# Altium project activator.PrjPcb
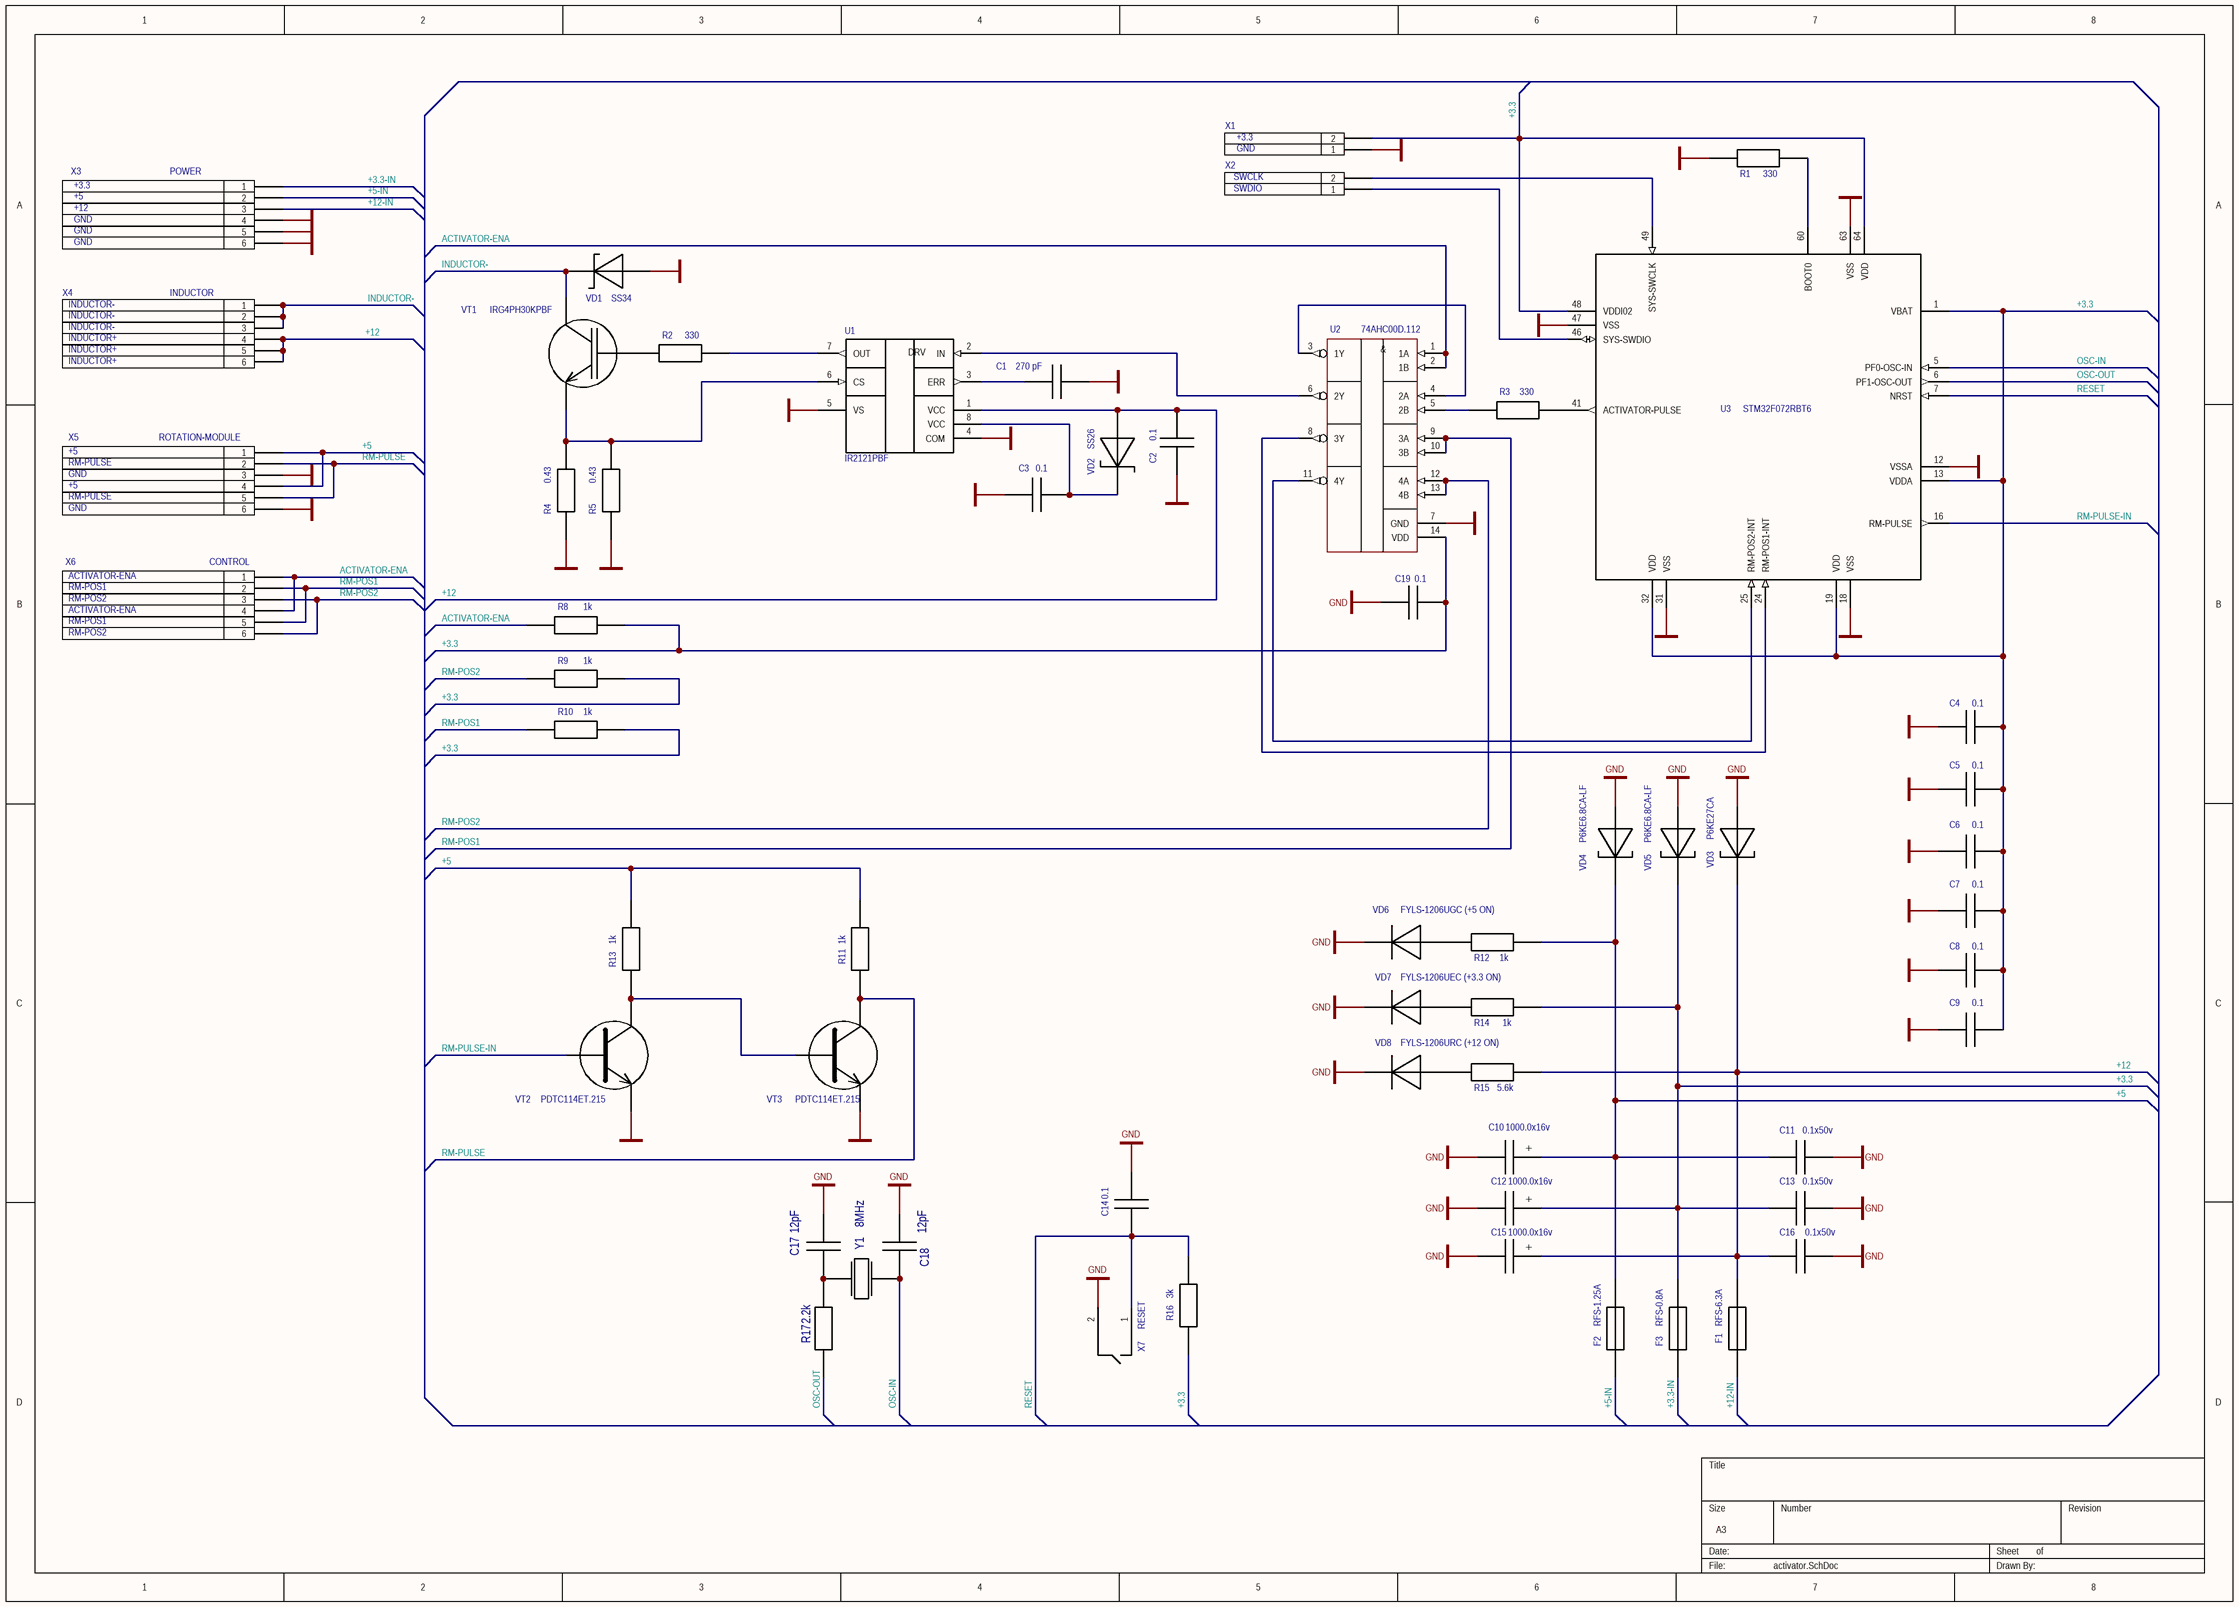
[diagram p0: activator.SchDoc]
1 sheet, 59 parts. Net scope: global (net labels, ports and power ports of the same name join across sheets).
Board file: activator.PcbDoc

## Sheet activator.SchDoc
size A3

### Parts
C1  270 pF  [CAPC3216X05N]
C2  0.1  [CAPC3216X05N]
C3  0.1  [CAPC3216X05N]
C4  0.1  [CAPC1608X05N]
C5  0.1  [CAPC1608X05N]
C6  0.1  [CAPC1608X05N]
C7  0.1  [CAPC1608X05N]
C8  0.1  [CAPC1608X05N]
C9  0.1  [CAPC1608X05N]
C10  1000.0x16v  [C-LOW-ESR-10-12.5]
C11  0.1x50v  [CAPC3216X05N]
C12  1000.0x16v  [C-LOW-ESR-10-12.5]
C13  0.1x50v  [CAPC3216X05N]
C14  0.1  [CAPC1608X05N]
C15  1000.0x16v  [C-LOW-ESR-10-12.5]
C16  0.1x50v  [CAPC3216X05N]
C17  12pF  [CAPC1608X05N]
C18  12pF  [CAPC1608X05N]
C19  0.1  [CAPC2012X04N]
F1  RFS-6.3A  [MRT-FUSE]
F2  RFS-1.25A  [MRT-FUSE]
F3  RFS-0.8A  [MRT-FUSE]
R1  330  [RESC1608X05N]
R2  330  [RESC3216X05N]
R3  330  [RESC2012X04N]
R4  0.43  [SQP-5W]
R5  0.43  [SQP-5W]
R8  1k  [RESC3216X05N]
R9  1k  [RESC3216X05N]
R10  1k  [RESC3216X05N]
R11  1k  [RESC2012X04N]
R12  1k  [RESC2012X04N]
R13  1k  [RESC2012X04N]
R14  1k  [RESC2012X04N]
R15  5.6k  [RESC2012X04N]
R16  3k  [RESC1608X05N]
R17  2.2k  [RESC1608X05N]
U1  IR2121PBF  [DIP8]
U2  74AHC00D.112  [SOIC127P600X175-14N]
U3  STM32F072RBT6  [TSQFP50P1200X1200X160-64N]
VD1  SS34  [DIOM6959X26N]
VD2  SS26  [DIOM4336X21N]
VD3  P6KE27CA  [P6KE27CA]
VD4  P6KE6.8CA-LF  [P6KE27CA]
VD5  P6KE6.8CA-LF  [P6KE27CA]
VD6  FYLS-1206UGC (+5 ON)  [CAPMP3216X11N]
VD7  FYLS-1206UEC (+3.3 ON)  [CAPMP3216X11N]
VD8  FYLS-1206URC (+12 ON)  [CAPMP3216X11N]
VT1  IRG4PH30KPBF  [TO-247AC]
VT2  PDTC114ET.215  [SOT95P238X102-3N]
VT3  PDTC114ET.215  [SOT95P238X102-3N]
X1  Jamper ZL201  [ZL201-2]  (value not drawn)
X2  Jamper ZL201  [ZL201-2]  (value not drawn)
X3  POWER  [MINI-FIT-6WAY-SM]
X4  INDUCTOR  [MINI-FIT-6WAY-SM]
X5  ROTATION-MODULE  [MINI-FIT-6WAY-SM]
X6  CONTROL  [MINI-FIT-6WAY-SM]
X7  RESET  [TACT SWITCH]
Y1  8MHz  [HC49LT]

### Nets
GND: C1.2 C2.1 C3.1 C4.1 C5.1 C6.1 C7.1 C8.1 C9.1 C10.2 C11.2 C12.2 C13.2 C14.2 C15.2 C16.2 C17.1 C18.1 C19.1 R1.1 R4.1 R5.1 U1.4(COM) U1.5(VS) U2.7(GND) U3.12(VSSA) U3.18(VSS) U3.31(VSS) U3.47(VSS) U3.63(VSS) VD1.2(A) VD3.A VD4.A VD5.A VD6.1(C) VD7.1(C) VD8.1(C) VT2.2(E) VT3.2(E) X1.1 X3.4 X3.5 X3.6 X5.3 X5.6 X7.2
+3.3: C4.2 C5.2 C6.2 C7.2 C8.2 C9.2 C12.1(+) C13.1 C19.2 F3.1 R8.2 R9.2 R10.2 R14.2 R16.1 U2.14(VDD) U3.1(VBAT) U3.13(VDDA) U3.19(VDD) U3.32(VDD) U3.48(VDDI02) U3.64(VDD) VD5.K X1.2
+3.3-IN: F3.2 X3.1
+5: C10.1(+) C11.1 F2.1 R11.2 R12.2 R13.2 VD4.K X5.1 X5.4
+5-IN: F2.2 X3.2
+12: C2.2 C15.1(+) C16.1 F1.1 R15.2 U1.1(VCC) VD2.2(A) VD3.K X4.4 X4.5 X4.6
+12-IN: F1.2 X3.3
ACTIVATOR-ENA: R8.1 U2.1(1A) U2.2(1B) X6.1 X6.4
INDUCTOR-: VD1.1(C) VT1.2(C) X4.1 X4.2 X4.3
OSC-IN: C18.2 U3.5(PF0-OSC-IN) Y1.2
OSC-OUT: R17.2 U3.6(PF1-OSC-OUT)
RESET: C14.1 R16.2 U3.7(NRST) X7.1
RM-POS1: R10.1 U2.9(3A) U2.10(3B) X6.2 X6.5
RM-POS2: R9.1 U2.12(4A) U2.13(4B) X6.3 X6.6
RM-PULSE: R11.1 VT3.3(C) X5.2 X5.5
RM-PULSE-IN: U3.16(RM-PULSE) VT2.1(B)
NetC1_1: C1.1 U1.3(ERR)
NetC3_2: C3.2 U1.8(VCC) VD2.1(C)
NetC17_2: C17.2 R17.1 Y1.1
NetR1_2: R1.2 U3.60(BOOT0)
NetR2_1: R2.1 VT1.1(G)
NetR2_2: R2.2 U1.7(OUT)
NetR3_1: R3.1 U2.5(2B)
NetR3_2: R3.2 U3.41(ACTIVATOR-PULSE)
NetR4_2: R4.2 R5.2 U1.6(CS) VT1.3(E)
NetR12_1: R12.1 VD6.2(A)
NetR13_1: R13.1 VT2.3(C) VT3.1(B)
NetR14_1: R14.1 VD7.2(A)
NetR15_1: R15.1 VD8.2(A)
NetU1_2: U1.2(IN) U2.6(2Y)
NetU2_3: U2.3(1Y) U2.4(2A)
NetU2_8: U2.8(3Y) U3.24(RM-POS1-INT)
NetU2_11: U2.11(4Y) U3.25(RM-POS2-INT)
NetU3_46: U3.46(SYS-SWDIO) X2.1
NetU3_49: U3.49(SYS-SWCLK) X2.2

Not connected (* = marked no-connect by the designer): U3 2(PC13) 3(PC14-OSC32-IN) 4(PC15-OSC32-OUT) 8(PC0) 9(PC1) 10(PC2) 11(PC3) 14(PA0) 15(PA1) 17(PA3) 20(PA4) 21(PA5) 22(PA6) 23(PA7) 26(PB0) 27(PB1) 28(PB2) 29(PB10) 30(PB11) 33(PB12) 34(PB13) 35(PB14) 36(PB15) 37(PC6) 38(PC7) 39(PC8) 40(PC9) 42(PA9) 43(PA10) 44(PA11) 45(PA12) 50(PA15) 51(PC10) 52(PC11) 53(PC12) 54(PD2) 55(PB3) 56(PB4) 57(PB5) 58(PB6) 59(PB7) 61(PB8) 62(PB9)

### Notes on the sheet
- +3.3
- SWCLK
- SWDIO
- GND
- +12
- +5
- INDUCTOR-
- INDUCTOR+
- RM-PULSE
- ACTIVATOR-ENA
- RM-POS1
- RM-POS2
- (in symbol 74AHC00D.112) &
- (in symbol IR2121PBF) DRV

### Library data of the parts
C1-C9 C11 C13 C14 C16-C19 = C: SMD конденсатор; Ref: http://www.kosmodrom.com.ua/prodlist.php?name=cap1206
C10 C12 C15 = C-LOW-ESR-RADIAL: Выводной электролит
F1-F3 = FUSE: Вставка плавкая; Ref: http://www.kosmodrom.com.ua/el.php?name=RFT-2.5A
R1-R3 R8-R17 = R: SMD резистор; Ref: http://www.kosmodrom.com.ua/prodlist.php?name=res1206
R4 R5 = R5W: Резистор керамика 5 ватт; Ref: https://voron.ua/catalog/001676
U1 = IR2121PBF: IGBT-MOSFET DRIVER
U2 = 74AHC00D.112: 2И-НЕ 4 ВЕНТИЛЯ
U3 = STM32F072RBT6: Микроконтроллер
VD1 = SS34: Диод Шоттки; Ref: http://www.kosmodrom.com.ua/prodlist.php?page=0&name=SS34&okbutton=%CF%EE%E8%F1%EA+%EF%EE+%F1%EA%EB%E0%E4%F3
VD2 = SS26: диод Шоттки
VD3-VD5 = P6KE27CA: Cупрессор; Ref: https://prom.ua/p207053054-p6ke27ca;all.html
VD6-VD8 = FYLS-1206: Светодиод; Ref: http://www.kosmodrom.com.ua/prodlist.php?page=0&name=FYLS-1206&okbutton=%CF%EE%E8%F1%EA+%EF%EE+%F1%EA%EB%E0%E4%F3
VT1 = IRG4PH30KPBF: IGBT transistor
VT2 VT3 = PDTC114ET.215: NPN transistor with bias circuit
X3-X6 = MINI-FIT-6-WAY-M
X7 = TACT SWITCH
Y1 = CERAMIC-RESONATOR: Кварцевый резонатор; Ref( 8MHz): http://www.kosmodrom.com.ua/el.php?name=KX-13-8.0-MHz; Ref (6MHz): http://www.kosmodrom.com.ua/el.php?name=KX-13%206.0%20MHz